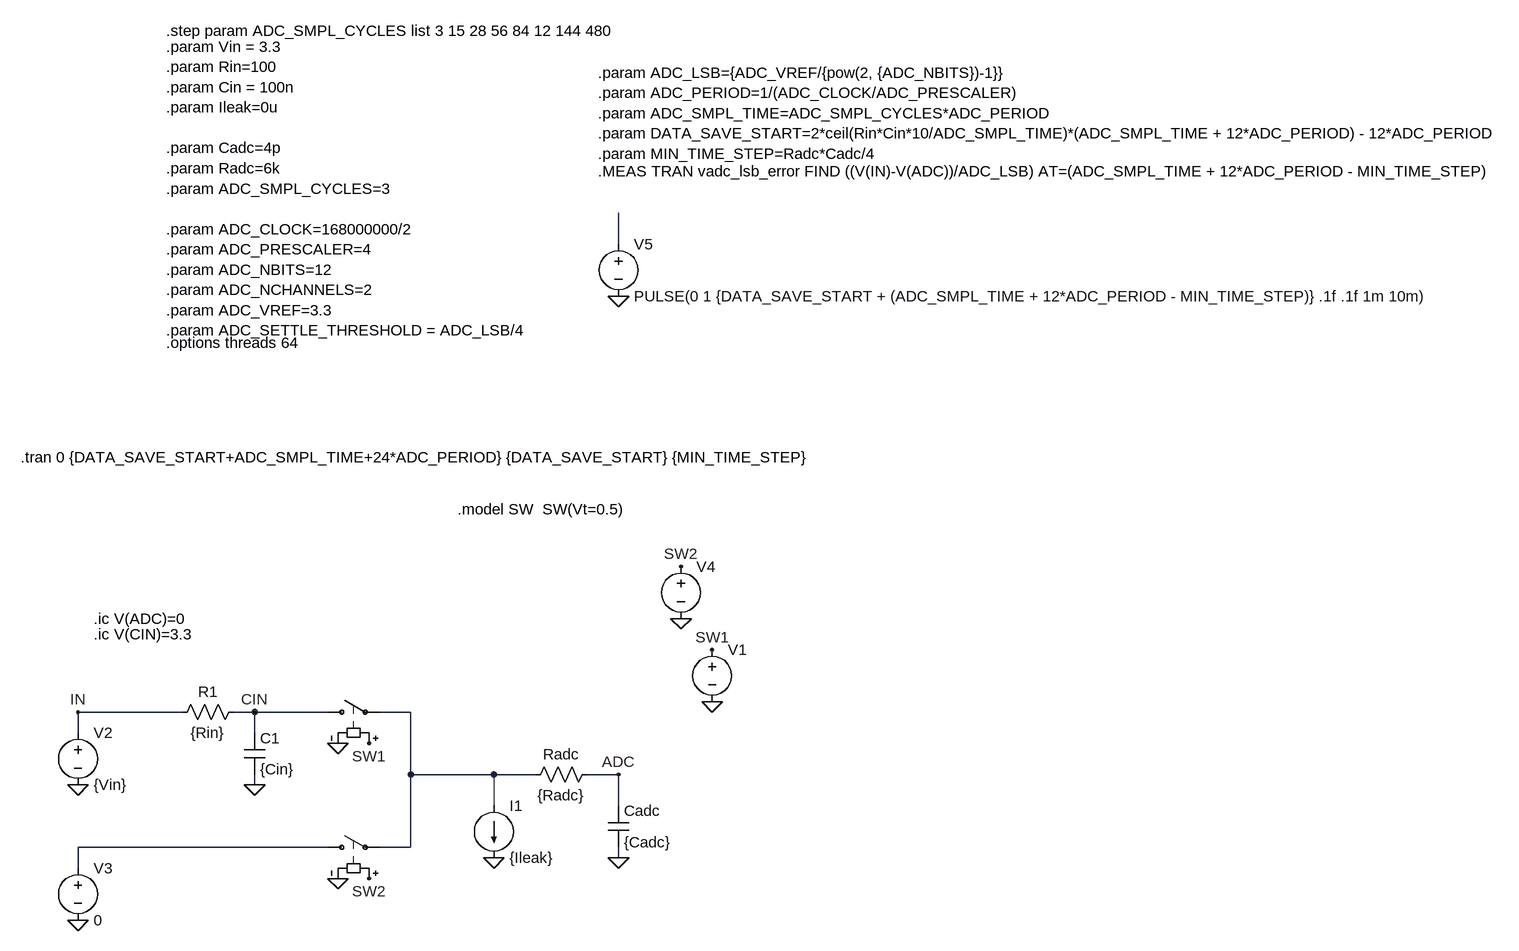
[diagram p0: schematic cin_vs_lsb_error.asc]
cin_vs_lsb_error.asc, the LTspice schematic file:
Version 4.1
SHEET 1 2428 680
WIRE 512 -560 512 -608
WIRE -160 160 -320 160
WIRE -48 160 -80 160
WIRE 64 160 -48 160
WIRE 192 160 144 160
WIRE -320 192 -320 160
WIRE -48 192 -48 160
WIRE 192 256 192 160
WIRE 320 256 192 256
WIRE 384 256 320 256
WIRE 512 256 464 256
WIRE -48 272 -48 256
WIRE 320 304 320 256
WIRE 512 304 512 256
WIRE 64 368 -320 368
WIRE 192 368 192 256
WIRE 192 368 144 368
WIRE 512 384 512 368
WIRE -320 400 -320 368
FLAG 80 208 0
FLAG 512 384 0
FLAG 128 208 SW1
FLAG 656 144 0
FLAG -320 160 IN
FLAG 656 64 SW1
FLAG -320 272 0
FLAG 512 256 ADC
FLAG -48 272 0
FLAG 320 384 0
FLAG -48 160 CIN
FLAG 80 416 0
FLAG 128 416 SW2
FLAG -320 480 0
FLAG 608 16 0
FLAG 608 -64 SW2
FLAG 512 -480 0
SYMBOL sw 48 160 R270
WINDOW 0 24 16 Invisible 2
WINDOW 3 24 96 Invisible 2
SYMATTR InstName S1
SYMBOL res 480 240 R90
WINDOW 0 0 56 VBottom 2
WINDOW 3 32 56 VTop 2
SYMATTR InstName Radc
SYMATTR Value {Radc}
SYMBOL cap 496 304 R0
SYMATTR InstName Cadc
SYMATTR Value {Cadc}
SYMBOL voltage 656 48 R0
WINDOW 3 24 44 Invisible 2
WINDOW 123 0 0 Left 0
WINDOW 39 0 0 Left 0
SYMATTR Value PULSE(0 1 0 0.001f 0.001f {ADC_SMPL_TIME} {ADC_NCHANNELS*(ADC_SMPL_TIME + 12*ADC_PERIOD)})
SYMATTR InstName V1
SYMBOL voltage -320 176 R0
WINDOW 123 0 0 Left 0
WINDOW 39 0 0 Left 0
SYMATTR InstName V2
SYMATTR Value {Vin}
SYMBOL cap -64 192 R0
SYMATTR InstName C1
SYMATTR Value {Cin}
SYMBOL res -64 144 R90
WINDOW 0 0 56 VBottom 2
WINDOW 3 32 56 VTop 2
SYMATTR InstName R1
SYMATTR Value {Rin}
SYMBOL current 320 304 R0
WINDOW 123 0 0 Left 0
WINDOW 39 0 0 Left 0
SYMATTR InstName I1
SYMATTR Value {Ileak}
SYMBOL sw 48 368 R270
WINDOW 0 24 16 Invisible 2
WINDOW 3 24 96 Invisible 2
SYMATTR InstName S2
SYMBOL voltage -320 384 R0
WINDOW 123 0 0 Left 0
WINDOW 39 0 0 Left 0
SYMATTR InstName V3
SYMATTR Value 0
SYMBOL voltage 608 -80 R0
WINDOW 3 24 44 Invisible 2
WINDOW 123 0 0 Left 0
WINDOW 39 0 0 Left 0
SYMATTR Value PULSE(0 1 {ADC_SMPL_TIME + 12*ADC_PERIOD} 0.001f 0.001f {ADC_SMPL_TIME} {ADC_NCHANNELS*(ADC_SMPL_TIME + 12*ADC_PERIOD)})
SYMATTR InstName V4
SYMBOL voltage 512 -576 R0
WINDOW 123 0 0 Left 0
WINDOW 39 0 0 Left 0
SYMATTR InstName V5
SYMATTR Value PULSE(0 1 {DATA_SAVE_START + (ADC_SMPL_TIME + 12*ADC_PERIOD - MIN_TIME_STEP)} .1f .1f 1m 10m)
TEXT 264 -152 Left 2 !.model SW  SW(Vt=0.5)
TEXT 480 -672 Left 2 !.MEAS TRAN vadc_lsb_error FIND ((V(IN)-V(ADC))/ADC_LSB) AT=(ADC_SMPL_TIME + 12*ADC_PERIOD - MIN_TIME_STEP)
TEXT -184 -864 Left 2 !.param Vin = 3.3\n.param Rin=100\n.param Cin = 100n\n.param Ileak=0u\n \n.param Cadc=4p\n.param Radc=6k\n.param ADC_SMPL_CYCLES=3\n \n.param ADC_CLOCK=168000000/2\n.param ADC_PRESCALER=4\n.param ADC_NBITS=12\n.param ADC_NCHANNELS=2\n.param ADC_VREF=3.3\n.param ADC_SETTLE_THRESHOLD = ADC_LSB/4
TEXT 480 -824 Left 2 !.param ADC_LSB={ADC_VREF/{pow(2, {ADC_NBITS})-1}}\n.param ADC_PERIOD=1/(ADC_CLOCK/ADC_PRESCALER)\n.param ADC_SMPL_TIME=ADC_SMPL_CYCLES*ADC_PERIOD\n.param DATA_SAVE_START=2*ceil(Rin*Cin*10/ADC_SMPL_TIME)*(ADC_SMPL_TIME + 12*ADC_PERIOD) - 12*ADC_PERIOD\n.param MIN_TIME_STEP=Radc*Cadc/4
TEXT -408 -232 Left 2 !.tran 0 {DATA_SAVE_START+ADC_SMPL_TIME+24*ADC_PERIOD} {DATA_SAVE_START} {MIN_TIME_STEP}
TEXT -296 40 Left 2 !.ic V(CIN)=3.3
TEXT -296 16 Left 2 !.ic V(ADC)=0
TEXT -184 -408 Left 2 !.options threads 64
TEXT -184 -888 Left 2 !.step param ADC_SMPL_CYCLES list 3 15 28 56 84 12 144 480

The netlist it stands for:
* cin_vs_lsb_error.asc
S1 CIN N002 SW1 0 SW
Radc ADC N002 {Radc}
Cadc ADC 0 {Cadc}
V1 SW1 0 PULSE(0 1 0 0.001f 0.001f {ADC_SMPL_TIME} {ADC_NCHANNELS*(ADC_SMPL_TIME + 12*ADC_PERIOD)})
V2 IN 0 {Vin}
C1 CIN 0 {Cin}
R1 CIN IN {Rin}
I1 N002 0 {Ileak}
S2 N003 N002 SW2 0 SW
V3 N003 0 0
V4 SW2 0 PULSE(0 1 {ADC_SMPL_TIME + 12*ADC_PERIOD} 0.001f 0.001f {ADC_SMPL_TIME} {ADC_NCHANNELS*(ADC_SMPL_TIME + 12*ADC_PERIOD)})
V5 N001 0 PULSE(0 1 {DATA_SAVE_START + (ADC_SMPL_TIME + 12*ADC_PERIOD - MIN_TIME_STEP)} .1f .1f 1m 10m)
.model SW  SW(Vt=0.5)
.MEAS TRAN vadc_lsb_error FIND ((V(IN)-V(ADC))/ADC_LSB) AT=(ADC_SMPL_TIME + 12*ADC_PERIOD - MIN_TIME_STEP)
.param Vin = 3.3
.param Rin=100
.param Cin = 100n
.param Ileak=0u
.param Cadc=4p
.param Radc=6k
.param ADC_SMPL_CYCLES=3
.param ADC_CLOCK=168000000/2
.param ADC_PRESCALER=4
.param ADC_NBITS=12
.param ADC_NCHANNELS=2
.param ADC_VREF=3.3
.param ADC_SETTLE_THRESHOLD = ADC_LSB/4
.param ADC_LSB={ADC_VREF/{pow(2, {ADC_NBITS})-1}}
.param ADC_PERIOD=1/(ADC_CLOCK/ADC_PRESCALER)
.param ADC_SMPL_TIME=ADC_SMPL_CYCLES*ADC_PERIOD
.param DATA_SAVE_START=2*ceil(Rin*Cin*10/ADC_SMPL_TIME)*(ADC_SMPL_TIME + 12*ADC_PERIOD) - 12*ADC_PERIOD
.param MIN_TIME_STEP=Radc*Cadc/4
.tran 0 {DATA_SAVE_START+ADC_SMPL_TIME+24*ADC_PERIOD} {DATA_SAVE_START} {MIN_TIME_STEP}
.ic V(CIN)=3.3
.ic V(ADC)=0
.options threads 64
.step param ADC_SMPL_CYCLES list 3 15 28 56 84 12 144 480
.backanno
.end